# Altium schematic sheet USB.SchDoc
size A4
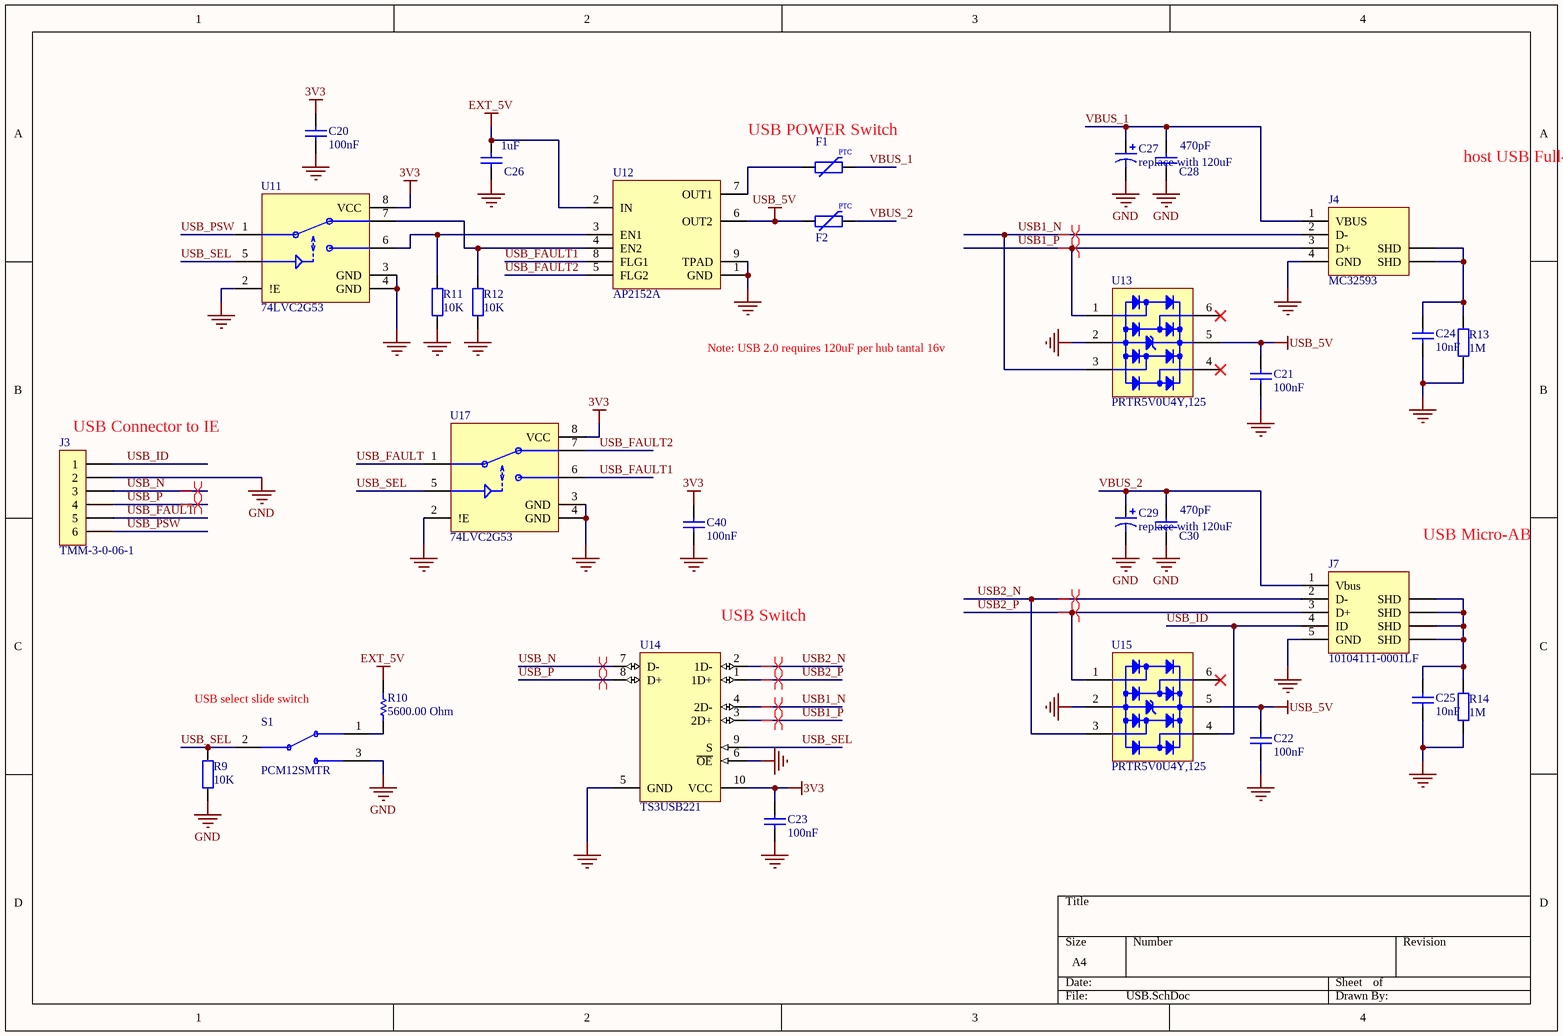
[diagram p0: USB.SchDoc]

## Parts
C20  value 100nF  [CAPC0402(1005)60_L]  (hidden comment: CAP 100nF 10V 0402(1005))
C21  value 100nF  [CAPC0402(1005)60_L]  (hidden comment: CAP 100nF 10V 0402(1005))
C22  value 100nF  [CAPC0402(1005)60_L]  (hidden comment: CAP 100nF 10V 0402(1005))
C23  value 100nF  [CAPC0402(1005)60_L]  (hidden comment: CAP 100nF 10V 0402(1005))
C24  value 10nF  [CAPC0402(1005)60_N]  (hidden comment: CAP 10nF 50V 0402(1005))
C25  value 10nF  [CAPC0402(1005)60_N]  (hidden comment: CAP 10nF 50V 0402(1005))
C26  value 1uF  [CAPC0603(1608)100_N]  (hidden comment: CAP 2.2uF 16V 0603(1608))
C27  replace with 120uF  [AVX-CAPC3528_V]
C28  value 470pF  [CAPC0603(1608)100_M]  (hidden comment: CAP 470pF 16V 0603(1608))
C29  replace with 120uF  [AVX-CAPC3528_V]
C30  value 470pF  [CAPC0603(1608)100_M]  (hidden comment: CAP 470pF 16V 0603(1608))
C40  value 100nF  [CAPC0402(1005)60_L]  (hidden comment: CAP 100nF 10V 0402(1005))
F1  MF-PSMF050X-2  [RESC0805(2012)_L]  (value not drawn)
F2  MF-PSMF050X-2  [RESC0805(2012)_L]  (value not drawn)
J3  TMM-3-0-06-1  [Micro-Match_6pin]
J4  MC32593  [MC32593]
J7  10104111-0001LF  [10104111-0001LF]
R9  value 10K  [RESC0402(1005)_L]  (hidden comment: 10K 1% 0402(1005))
R10  value 5600.00 Ohm  [RESC0402(1005)_L]  (hidden comment: 5K6 5% 0402(1005))
R11  value 10K  [RESC0402(1005)_N]  (hidden comment: 10K 1% 0402(1005))
R12  value 10K  [RESC0402(1005)_N]  (hidden comment: 10K 1% 0402(1005))
R13  value 1M  [RESC0402(1005)_L]  (hidden comment: 1M  1% 0402(1005))
R14  value 1M  [RESC0402(1005)_L]  (hidden comment: 1M  1% 0402(1005))
S1  PCM12SMTR  [PCM12SMTR switch footprint]
U11  74LVC2G53  [VSSOP8_SOT765-1]
U12  AP2152A  [SOP127P600-8N]
U13  PRTR5V0U4Y,125  [SOT363_L]
U14  TS3USB221  [RSE10]
U15  PRTR5V0U4Y,125  [SOT363_L]
U17  74LVC2G53  [VSSOP8_SOT765-1]

## Nets
3V3: C20.2 C23.2 C40.2 U11.8(VCC) U14.10(VCC) U17.8(VCC)
EXT_5V: C26.2 R10.2 U12.2(IN)
GND: C20.1 C21.1 C22.1 C23.1 C24.1 C25.1 C26.1 C27.2 C28.1 C29.2 C30.1 C40.1 J3.2 J4.4(GND) J7.5(GND) R9.1 R11.1 R12.1 R13.1 R14.1 S1.3(NC2) U11.2(!E) U11.3(GND) U11.4(GND) U12.1(GND) U12.9(TPAD) U13.2 U14.5(GND) U14.6(~{OE}) U15.2 U17.2(!E) U17.3(GND) U17.4(GND)
USB_5V: C21.2 C22.2 F2.1 U12.6(OUT2) U13.5 U15.5
USB1_N: J4.2(D-) U13.3 U14.4(2D-)
USB1_P: J4.3(D+) U13.1 U14.3(2D+)
USB2_N: J7.2(D-) U14.2(1D-) U15.3
USB2_P: J7.3(D+) U14.1(1D+) U15.1
USB_FAULT: J3.5 U17.1(Z)
USB_FAULT1: U12.8(FLG1) U17.6(Y1)
USB_FAULT2: U12.5(FLG2) U17.7(Y0)
USB_ID: J3.1 J7.4(ID) U15.4
USB_N: J3.3 U14.7(D-)
USB_P: J3.4 U14.8(D+)
USB_PSW: J3.6 U11.1(Z)
USB_SEL: R9.2 S1.2(NO1) U11.5(S) U14.9(S) U17.5(S)
VBUS_1: C27.1 C28.2 F1.2 J4.1(VBUS)
VBUS_2: C29.1 C30.2 F2.2 J7.1(Vbus)
NetC24_2: C24.2 J4.5(SHD) J4.6(SHD) R13.2
NetC25_2: C25.2 J7.6(SHD) J7.7(SHD) J7.8(SHD) J7.9(SHD) R14.2
NetF1_1: F1.1 U12.7(OUT1)
NetR10_1: R10.1 S1.1(NC1)
NetR11_2: R11.2 U11.6(Y1) U12.3(EN1)
NetR12_2: R12.2 U11.7(Y0) U12.4(EN2)

Not connected (* = marked no-connect by the designer): U13 4* 6*; U15 6*

## Layout directives
differential pair: USB1_N, USB1_P, USB2_N, USB2_P, USB_N, USB_P

## Notes on the sheet
- USB POWER Switch
- host USB Full-size type A
- Note: USB 2.0 requires 120uF per hub tantal 16v
- (near J3) USB Connector to IE
- (near J7) USB Micro-AB
- (near U14) USB Switch
- (near S1) USB select slide switch
- (in symbol MF-PSMF050X-2) PTC

## Library data of the parts
C20-C23 C40 = CMP-1034-02064-1: CAP 100nF 10V ±5% 0402 (1005 Metric) Thickness 0.6mm SMD; Tolerance: Â±5%; Case-EIA: 0402; Case-Metric: 1005; Max Thickness: 0.6 mm; Rated Voltage: 10 V; Technology: SMT
C24 C25 = CMP-1034-01886-1: CAP 10nF 50V ±10% 0402 (1005 Metric) Thickness 0.6mm SMD; Case-EIA: 0402; Case-Metric: 1005; Tolerance: ±10%; Rated Voltage: 50 V; Max Thickness: 0.6 mm; Technology: SMT
C26 = CMP-1035-02765-1: CAP 2.2uF 16V ±20% 0603 (1608 Metric) Thickness 1mm SMD; Case-EIA: 0603; Case-Metric: 1608; Max Thickness: 1 mm; Rated Voltage: 16 V; Tolerance: ±20%; Technology: SMT
C27 C29 = CMP-0279-00001-1: Capacitor, Tantalum, 10uF 10% 20V MCCT-B (3528); PartNumber: TAJB106K020R; Manufacturer: AVX; Polarity: Polarized; PackageDescription: 2-Pin SMT Capacitor, 3.5 x 2.8 mm Body; ComponentLink1URL: http://www.avx.com/; PackageReference: CAPC3528; ComponentLink2Description: Datasheet; Capacitance: 10uF; Technology: Tantalum; ComponentLink2URL: http://www.avx.com/docs/Catalogs/taj.pdf; Tolerance: 10%; ComponentLink1Description: Manufacturer URL; Rated Voltage: 20V; DatasheetVersion: Jun-13; Mounting Technology: Surface Mount
C28 C30 = CMP-1035-01663-1: CAP 470pF 16V ±1% 0603 (1608 Metric) Thickness 1mm SMD; Case-EIA: 0603; Case-Metric: 1608; Tolerance: Â±1%; Technology: SMT; Rated Voltage: 16 V; Max Thickness: 1 mm
F1 = MF-PSMF050X-2: PTC Resettable Fuse; Manufacturer: Bourns; Hold Current: 0.5 A; Resistance: 900 mOhms; Maximum Voltage: 6 VDC; Type: PTC Resettable Fuses; Current Rating - Max: 40 A; Trip Current: 1 A; Supplier 1: Farnell; Supplier 2: Digi-Key; Supplier 3: Mouser; Supplier Part Number 1: 1294876; Supplier Part Number 2: MF-PSMF050X-2CT-ND; Supplier Part Number 3: 652-MF-PSMF050X-2; Dimensions: 2.3 mm L x 1.5 mm W x 0.85 mm  H; Mounting Style: SMD/SMT; Package/Case: 0805 (2012 metric); Operating Temperature Range: - 40 C to + 85 C; Manufacturer Part Number: MF-PSMF050X-2
F2 = MF-PSMF050X-2: PTC Resettable Fuse; CurrentTrip: 1A; CurrentHold: 0.5A; Supplier 1: Farnell; Supplier 2: Digi-Key; Supplier 3: Mouser; Supplier Part Number 1: 1294876; Supplier Part Number 2: MF-PSMF050X-2CT-ND; Supplier Part Number 3: 652-MF-PSMF050X-2
J3 = TMM-3-0-06-1: Micro-Match male 6 pin  Through Hole Vertical, Pitch 1.27mm; Manufacturer: AMPHENOL; Supplier Part Number 1: 1865054; Supplier Part Number 2: N/A; Supplier Part Number 3: N/A; Supplier 1: Farnell; Supplier 2: Digi-key; Supplier 3: Mouser; Manufacturer Part Number: TMM-3-0-06-1
J4 = MC32593: USB, Type A, Right Angle, THT; Manufacturer: MULTICOMP; Supplier 1: Farnell; Supplier Part Number 1: 1696534; Manufacturer Part Number: MC32593; ComponentLink1URL: http://www.farnell.com/cad/328899.pdf; ComponentLink1Description: Datasheet; Supplier 2: Digikey; Supplier 3: Mouser; Supplier Part Number 2: N/A; Supplier Part Number 3: N/A
J7 = 10104111-0001LF: Micro USB 2.0, Type AB, Bottom Mount, SMT, Right Angle; Supplier 1: Farnell; Supplier 2: Digi-Key; Supplier 3: Mouser; Supplier Part Number 1: 2293755; Supplier Part Number 2: 609-4053-1-ND; Supplier Part Number 3: 649-10104111-0001LF
R9 R11 R12 = 10K 0402(1005)_1: 10K 0.063W 1% 0402 (1005 Metric)  SMD; Case-EIA: 0402; Case-Metric: 1005; Power: 0.063W; Technology: SMT; Tolerance: 1%
R10 = CMP-1011-00092-1: 5K6 0.063W 5% 0402 (1005 Metric)  SMD; Case-EIA: 0402; Case-Metric: 1005; Technology: SMT; Tolerance: 5 %; Power: 0.063 W
R13 R14 = 1M 0402(1005): 1M  0.063W 1% 0402 (1005 Metric)  SMD; Case-EIA: 0402; Case-Metric: 1005; Power: 0.063W; Technology: SMT; Tolerance: 1%
S1 = PCM12SMTR: slide switch; Manufacturer: C & K COMPONENTS; Supplier 1: Farnell; Supplier 2: Digi-Key; Supplier 3: Mouser; Supplier Part Number 1: 9575146; Supplier Part Number 2: 401-2016-1-ND; Supplier Part Number 3: 611-PCM12SMTR; Manufacturer Part Number: PCM12SMTR
U13 U15 = PRTR5V0U4Y,125: Integrated quad ultra-low capacitance ESD protection,  IEC 61000-4-2 level 4, ±8 kV contact discharge; Manufacturer: NXP; Supplier 1: Farnell; Supplier 2: Digi-Key; Supplier 3: Mouser; Supplier Part Number 1: 1757870; Supplier Part Number 2: 568-6542-1-ND; Supplier Part Number 3: 771-PRTR5V0U4Y125; ComponentLink1URL: http://www.farnell.com/datasheets/460678.pdf; ComponentLink1Description: Datasheet; Minimum Operating Temperature: - 40 C; Mounting Style: SMD/SMT; Manufacturer Part Number: PRTR5V0U4Y,125; Dimensions: 1.35 mm W x 2.2 mm L x 1 mm H; Maximum Operating Temperature: + 85 C
U14 = CMP-0309-00017-1: ESD Protected,High-Speed USB 2.0 (480-Mbps) 1:2 Multiplexer / Demultiplexer Switch, 1:2 Mux / Demux, 6 ohm RON, 2.5 to 3.3V, -40 to 85 degC, 10-Pin UQFN (RSE), Green (RoHS & no Sb/Br); PartNumber: TS3USB221ARSER; Manufacturer: Texas Instruments; ron(max)(ohms): 6; ESD HBM(kV): +/-7; ICC(uA): 30; Architecture: "1","2 mux/demux"; tpd max(ns): 0.25; OFF Time(Max)(ns): 12; Bandwidth(MHz): 900; Vcc range(V): 2.3 to 3.6; RON Mis-match(Max)(Ohms): 0.2; RON Flatness(Max)(Ohms): 1; IL OFF(Max)(nA): 2; SubFamily: USB Switch; Mounting Technology: Surface Mount; Code_JEDEC: MO-288-UEFD; ComponentLink2URL: http://www.ti.com/lit/ml/mpqf186c/mpqf186c.pdf; Eco-Plan: Green (RoHS & no Sb/Br); PackageVersion: revD, Jan-2011; PackageDescription: 10-Leads Plastic Quad Flatpack No-Lead, 2 x 1.5 x 0.55 mm Body, 0.5 mm Pitch; ComponentLink1Description: Datasheet; ON Time(Max)(ns): 30; DatasheetVersion: SCDS277; ComponentLink2Description: Package Specification; PackageReference: RSE10; Number of Channels: 2; ComponentLink1URL: http://www.ti.com/general/docs/lit/getliterature.tsp?genericPartNumber=TS3USB221A&fileType=pdf
U11 U17 = 74LVC2G53: Supplier 1: Farnell; Supplier 2: Digi-Key; Supplier 3: Mouser; Supplier Part Number 1: N/A; Supplier Part Number 2: 74LVC2G53DC,125-ND; Supplier Part Number 3: 771-LVC2G53DC125
U12 = AP2152A: Supplier 1: Farnell; Supplier 2: Digi-Key; Supplier 3: Mouser; Supplier Part Number 2: AP2152AMPG-13DITR-ND; Supplier Part Number 3: 621-AP2152AMPG-13